# Altium schematic sheet Supply.SchDoc
size A4
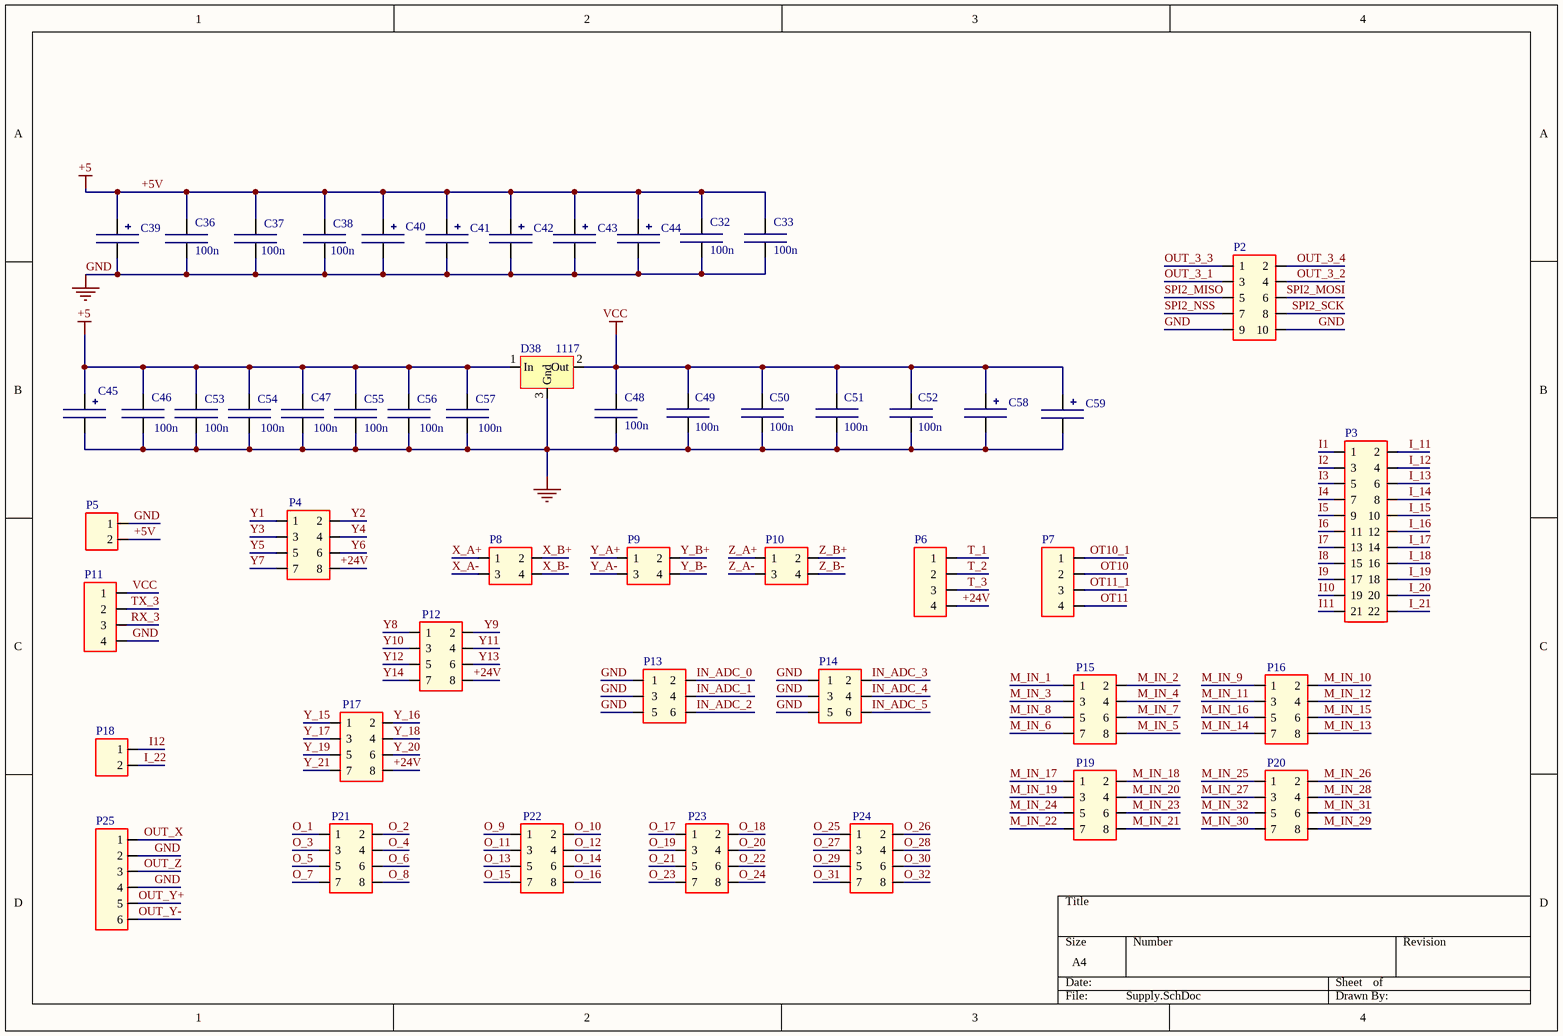
[diagram p0: Supply.SchDoc]

## Parts
C32  100n  [C0805]
C33  100n  [C0805]
C36  100n  [C0805]
C37  100n  [C0805]
C38  100n  [C0805]
C39  Capacitor_Polyar  [SMD_El_SizeA]  (value not drawn)
C40  Capacitor_Polyar  [SMD_El_SizeA]  (value not drawn)
C41  Capacitor_Polyar  [SMD_El_SizeA]  (value not drawn)
C42  Capacitor_Polyar  [SMD_El_SizeA]  (value not drawn)
C43  Capacitor_Polyar  [SMD_El_SizeA]  (value not drawn)
C44  Capacitor_Polyar  [SMD_El_SizeA]  (value not drawn)
C45  Capacitor_Polyar  [SMD_El_SizeA]  (value not drawn)
C46  100n  [C0805]
C47  100n  [C0805]
C48  100n  [C0805]
C49  100n  [C0805]
C50  100n  [C0805]
C51  100n  [C0805]
C52  100n  [C0805]
C53  100n  [C0805]
C54  100n  [C0805]
C55  100n  [C0805]
C56  100n  [C0805]
C57  100n  [C0805]
C58  Capacitor_Polyar  [SMD_El_SizeA]  (value not drawn)
C59  Capacitor_Polyar  [SMD_El_SizeA]  (value not drawn)
D38  1117  [SOT223]
P2  Con_5x2  [Con_5x2]  (value not drawn)
P3  Con_11x2  [Con_11x2]  (value not drawn)
P4  Con_4x2  [Con_4_2]  (value not drawn)
P5  KLS_2  [KLS-2]  (value not drawn)
P6  Con_4  [Con_4]  (value not drawn)
P7  Con_4  [Con_4]  (value not drawn)
P8  Con_2x2  [Con_2x2]  (value not drawn)
P9  Con_2x2  [Con_2x2]  (value not drawn)
P10  Con_2x2  [Con_2x2]  (value not drawn)
P11  Con_4  [Con_4]  (value not drawn)
P12  Con_4x2  [Con_4_2]  (value not drawn)
P13  Con_3x2  [Con_3x2]  (value not drawn)
P14  Con_3x2  [Con_3x2]  (value not drawn)
P15  Con_4x2  [Con_4_2]  (value not drawn)
P16  Con_4x2  [Con_4_2]  (value not drawn)
P17  Con_4x2  [Con_4_2]  (value not drawn)
P18  KLS_2  [KLS-2]  (value not drawn)
P19  Con_4x2  [Con_4_2]  (value not drawn)
P20  Con_4x2  [Con_4_2]  (value not drawn)
P21  Con_4x2  [Con_4_2]  (value not drawn)
P22  Con_4x2  [Con_4_2]  (value not drawn)
P23  Con_4x2  [Con_4_2]  (value not drawn)
P24  Con_4x2  [Con_4_2]  (value not drawn)
P25  KLS_6_5mm  [KLS_6_5MM]  (value not drawn)

## Nets
+5V: C32.1 C33.1 C36.1 C37.1 C38.1 C39.1 C40.1 C41.1 C42.1 C43.1 C44.1 C45.1 C46.1 C47.1 C53.1 C54.1 C55.1 C56.1 C57.1 D38.1(In) P5.2  [also labelled +5]
GND: C32.2 C33.2 C36.2 C37.2 C38.2 C39.2 C40.2 C41.2 C42.2 C43.2 C44.2 C45.2 C46.2 C47.2 C48.2 C49.2 C50.2 C51.2 C52.2 C53.2 C54.2 C55.2 C56.2 C57.2 C58.2 C59.2 D38.3(Gnd) P2.9 P2.10 P5.1 P11.4 P13.1 P13.3 P13.5 P14.1 P14.3 P14.5 P25.2 P25.4
VCC: C48.1 C49.1 C50.1 C51.1 C52.1 C58.1 C59.1 D38.2(Out) P11.1
+24V: P4.8 P6.4 P12.8 P17.8
I1: P3.1
I2: P3.3
I3: P3.5
I4: P3.7
I5: P3.9
I6: P3.11
I7: P3.13
I8: P3.15
I9: P3.17
I10: P3.19
I11: P3.21
I12: P18.1
I_11: P3.2
I_12: P3.4
I_13: P3.6
I_14: P3.8
I_15: P3.10
I_16: P3.12
I_17: P3.14
I_18: P3.16
I_19: P3.18
I_20: P3.20
I_21: P3.22
I_22: P18.2
IN_ADC_0: P13.2
IN_ADC_1: P13.4
IN_ADC_2: P13.6
IN_ADC_3: P14.2
IN_ADC_4: P14.4
IN_ADC_5: P14.6
M_IN_1: P15.1
M_IN_2: P15.2
M_IN_3: P15.3
M_IN_4: P15.4
M_IN_5: P15.8
M_IN_6: P15.7
M_IN_7: P15.6
M_IN_8: P15.5
M_IN_9: P16.1
M_IN_10: P16.2
M_IN_11: P16.3
M_IN_12: P16.4
M_IN_13: P16.8
M_IN_14: P16.7
M_IN_15: P16.6
M_IN_16: P16.5
M_IN_17: P19.1
M_IN_18: P19.2
M_IN_19: P19.3
M_IN_20: P19.4
M_IN_21: P19.8
M_IN_22: P19.7
M_IN_23: P19.6
M_IN_24: P19.5
M_IN_25: P20.1
M_IN_26: P20.2
M_IN_27: P20.3
M_IN_28: P20.4
M_IN_29: P20.8
M_IN_30: P20.7
M_IN_31: P20.6
M_IN_32: P20.5
O_1: P21.1
O_2: P21.2
O_3: P21.3
O_4: P21.4
O_5: P21.5
O_6: P21.6
O_7: P21.7
O_8: P21.8
O_9: P22.1
O_10: P22.2
O_11: P22.3
O_12: P22.4
O_13: P22.5
O_14: P22.6
O_15: P22.7
O_16: P22.8
O_17: P23.1
O_18: P23.2
O_19: P23.3
O_20: P23.4
O_21: P23.5
O_22: P23.6
O_23: P23.7
O_24: P23.8
O_25: P24.1
O_26: P24.2
O_27: P24.3
O_28: P24.4
O_29: P24.5
O_30: P24.6
O_31: P24.7
O_32: P24.8
OT10: P7.2
OT10_1: P7.1
OT11: P7.4
OT11_1: P7.3
OUT_3_1: P2.3
OUT_3_2: P2.4
OUT_3_3: P2.1
OUT_3_4: P2.2
OUT_X: P25.1
OUT_Y+: P25.5
OUT_Y-: P25.6
OUT_Z: P25.3
RX_3: P11.3
SPI2_MISO: P2.5
SPI2_MOSI: P2.6
SPI2_NSS: P2.7
SPI2_SCK: P2.8
T_1: P6.1
T_2: P6.2
T_3: P6.3
TX_3: P11.2
X_A+: P8.1
X_A-: P8.3
X_B+: P8.2
X_B-: P8.4
Y1: P4.1
Y2: P4.2
Y3: P4.3
Y4: P4.4
Y5: P4.5
Y6: P4.6
Y7: P4.7
Y8: P12.1
Y9: P12.2
Y10: P12.3
Y11: P12.4
Y12: P12.5
Y13: P12.6
Y14: P12.7
Y_15: P17.1
Y_16: P17.2
Y_17: P17.3
Y_18: P17.4
Y_19: P17.5
Y_20: P17.6
Y_21: P17.7
Y_A+: P9.1
Y_A-: P9.3
Y_B+: P9.2
Y_B-: P9.4
Z_A+: P10.1
Z_A-: P10.3
Z_B+: P10.2
Z_B-: P10.4

## Library data of the parts
C32 C33 C36-C38 C46-C57 = C0805
D38 = 7833_SOT223